# Altium schematic sheet Stepper Motor Driver.SchDoc
size A
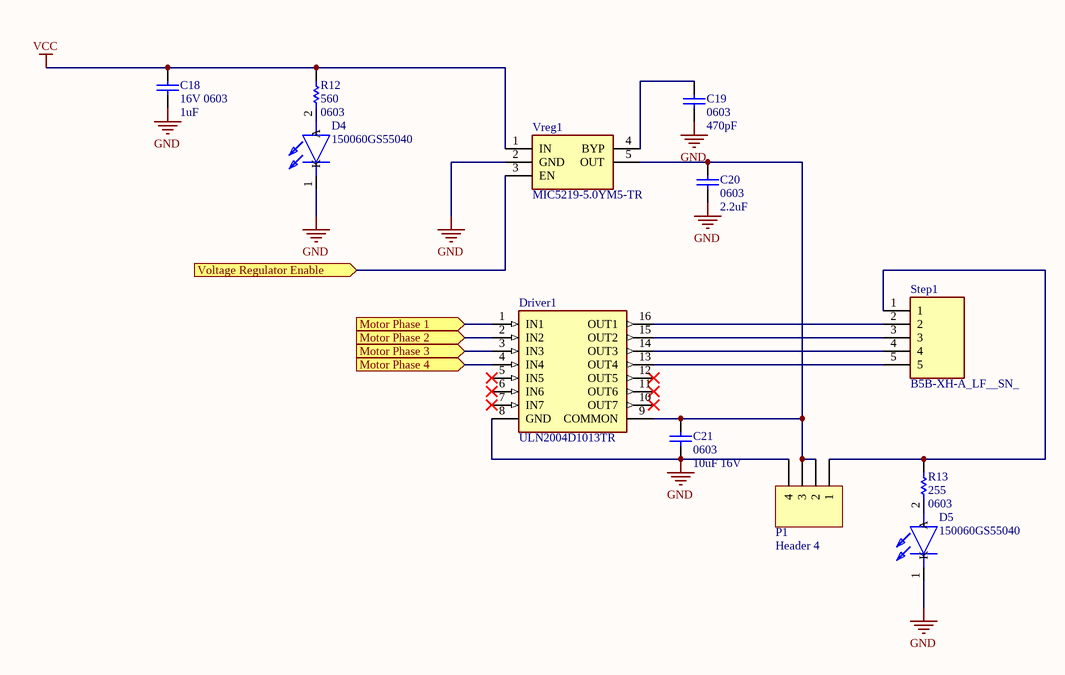
[diagram p0: Stepper Motor Driver.SchDoc]

## Parts
C18  16V 0603  value 1uF  [SMD-0603C]
C19  0603  value 470pF  [SMD-0603C]
C20  0603  value 2.2uF  [SMD-0603C]
C21  0603  value 10uF 16V  [SMD-0603C]
D4  150060GS55040  [LEDC1608X50N]
D5  150060GS55040  [LEDC1608X50N]
Driver1  ULN2004D1013TR  [SOIC127P600X175-16N]
P1  Header 4  [HDR1X4]
R12  560  value 0603  [SMD-0603-RES]
R13  255  value 0603  [SMD-0603-RES]
Step1  B5B-XH-A_LF__SN_  [SHDR5W64P0X250_1X5_1490X575X700P]
Vreg1  MIC5219-5.0YM5-TR  [SOT95P280X145-5N]

## Ports
Motor Phase 1 (in), Motor Phase 2 (in), Motor Phase 3 (in), Motor Phase 4 (in), Voltage Regulator Enable (in)

## Nets
GND: C18.1 C19.1 C20.1 C21.1 D4.1(K) D5.1(K) Driver1.8(GND) P1.4 Vreg1.2(GND)
VCC: C18.2 R12.1 Vreg1.1(IN)
Motor Phase 1: Driver1.1(IN1) ; port Motor Phase 1
Motor Phase 2: Driver1.2(IN2) ; port Motor Phase 2
Motor Phase 3: Driver1.3(IN3) ; port Motor Phase 3
Motor Phase 4: Driver1.4(IN4) ; port Motor Phase 4
Voltage Regulator Enable: Vreg1.3(EN) ; port Voltage Regulator Enable
NetC19_2: C19.2 Vreg1.4(BYP)
NetC20_2: C20.2 C21.2 Driver1.9(COMMON) P1.2 P1.3 Vreg1.5(OUT)
NetD4_2: D4.2(A) R12.2
NetD5_2: D5.2(A) R13.2
NetDriver1_13: Driver1.13(OUT4) Step1.5
NetDriver1_14: Driver1.14(OUT3) Step1.4
NetDriver1_15: Driver1.15(OUT2) Step1.3
NetDriver1_16: Driver1.16(OUT1) Step1.2
NetP1_1: P1.1 R13.1 Step1.1

Not connected (* = marked no-connect by the designer): Driver1 5(IN5)* 6(IN6)* 7(IN7)* 10(OUT7)* 11(OUT6)* 12(OUT5)*

## Library data of the parts
C18-C21 = Cap: Capacitor; Published: 8-Jun-2000; LatestRevisionDate: 17-Jul-2002; LatestRevisionNote: Re-released for DXP Platform.; PackageReference: RAD-0.3; Publisher: Altium Limited; PackageDescription: Radial Cap, Thru-Hole; 2 Leads; 0.3 in Pin Spacing
D4 D5 = 150060GS55040: LED; Manufacturer_Name: Wurth Elektronik; Datasheet Link: https://katalog.we-online.de/led/datasheet/150060GS55040.pdf; Height: 0.5mm; Manufacturer_Part_Number: 150060GS55040; Mouser Part Number: 710-150060GS55040; Mouser Price/Stock: https://www.mouser.com/Search/Refine.aspx?Keyword=710-150060GS55040; RS Part Number: 1766068P; RS Price/Stock: http://uk.rs-online.com/web/p/products/1766068P
Driver1 = ULN2004D1013TR: Integrated Circuit; Manufacturer_Name: STMicroelectronics; Allied_Number: 70391946; Datasheet Link: http://www.st.com/st-web-ui/static/active/en/resource/technical/document/datasheet/CD00001244.pdf; Height: 1.75mm; Manufacturer_Part_Number: ULN2004D1013TR; Mouser Part Number: 511-ULN2004D1013TR; Mouser Price/Stock: https://www.mouser.com/Search/Refine.aspx?Keyword=511-ULN2004D1013TR; RS Part Number: 6868161P; RS Price/Stock: http://uk.rs-online.com/web/p/products/6868161P; Allied Price/Stock: http://www.alliedelec.com/stmicroelectronics-uln2004d1013tr/70391946/
P1 = Header 4: Header, 4-Pin; LatestRevisionDate: 17-Jul-2002; LatestRevisionNote: Re-released for DXP Platform.; Publisher: Altium Limited
R12 R13 = Res1: Resistor; Published: 8-Jun-2000; LatestRevisionDate: 17-Jul-2002; LatestRevisionNote: Re-released for DXP Platform.; PackageReference: AXIAL-0.3; Publisher: Altium Limited; PackageDescription: Axial Device, Thru-Hole; 2 Leads; 0.3 in Pin Spacing
Step1 = B5B-XH-A_LF__SN_: 28BYJ-48 Stepper Motor; Manufacturer_Name: JST (JAPAN SOLDERLESS TERMINALS); Manufacturer_Part_Number: B5B-XH-A(LF)(SN); Datasheet Link: http://www.jst-mfg.com/product/pdf/eng/eXH.pdf; Height: 7mm; RS Part Number: 8201560P; RS Price/Stock: http://uk.rs-online.com/web/p/products/8201560P
Vreg1 = MIC5219-5.0YM5-TR: Integrated Circuit; Manufacturer_Name: Microchip; Datasheet Link: http://ww1.microchip.com/downloads/en/DeviceDoc/MIC5219-500mA-Peak-Output-LDO-Regulator-DS20006021A.pdf; Height: 1.45mm; Manufacturer_Part_Number: MIC5219-5.0YM5-TR; Mouser Part Number: 998-MIC5219-5.0YM5TR; Mouser Price/Stock: https://www.mouser.com/Search/Refine.aspx?Keyword=998-MIC5219-5.0YM5TR; RS Part Number: 9101755P; RS Price/Stock: http://uk.rs-online.com/web/p/products/9101755P